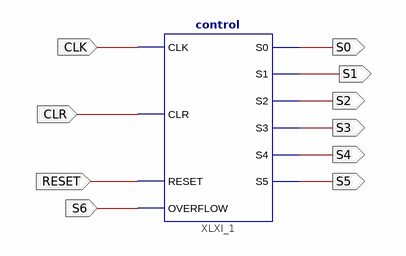
[diagram p0: schematic sheet 1]
// Xilinx ISE schematic controlTestSchematic.sch (spartan3e) as structural Verilog: 1 symbols, 10 ports
module controlTestSchematic (
  input  CLK,
  input  CLR,
  input  RESET,
  input  S6,
  output S0,
  output S1,
  output S2,
  output S3,
  output S4,
  output S5
);

  control XLXI_1 (
    .CLK(CLK), .CLR(CLR), .RESET(RESET), .OVERFLOW(S6), .S0(S0), .S1(S1), .S2(S2), .S3(S3), .S4(S4), .S5(S5));
endmodule
